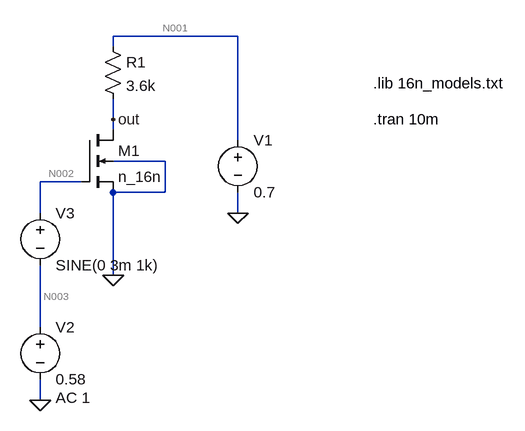
[diagram p0: schematic CS Stage - Resistive Load.asc]
CS Stage - Resistive Load.asc, the LTspice schematic file:
Version 4
SHEET 1 880 680
WIRE 128 -112 -64 -112
WIRE -64 -96 -64 -112
WIRE -64 16 -64 -16
WIRE -64 32 -64 16
WIRE 128 48 128 -112
WIRE 16 80 -64 80
WIRE -112 112 -176 112
WIRE 16 128 16 80
WIRE 16 128 -64 128
WIRE -176 160 -176 112
WIRE 128 160 128 128
WIRE -64 256 -64 128
WIRE -176 336 -176 240
WIRE -176 448 -176 416
FLAG -176 448 0
FLAG -64 256 0
FLAG 128 160 0
FLAG -64 16 out
SYMBOL nmos4 -112 32 R0
SYMATTR InstName M1
SYMATTR Value n_16n
SYMATTR Value2 l=32n w=900n
SYMBOL voltage 128 32 R0
WINDOW 123 0 0 Left 0
WINDOW 39 0 0 Left 0
SYMATTR InstName V1
SYMATTR Value 0.7
SYMBOL voltage -176 320 R0
WINDOW 123 24 124 Left 2
WINDOW 39 0 0 Left 0
SYMATTR Value2 AC 1
SYMATTR InstName V2
SYMATTR Value 0.58
SYMBOL res -80 -112 R0
SYMATTR InstName R1
SYMATTR Value 3.6k
SYMBOL voltage -176 144 R0
WINDOW 123 0 0 Left 0
WINDOW 39 0 0 Left 0
SYMATTR InstName V3
SYMATTR Value SINE(0 3m 1k)
TEXT 336 -40 Left 2 !.lib 16n_models.txt
TEXT 336 16 Left 2 !.tran 10m

The netlist it stands for:
* CS Stage - Resistive Load.asc
M1 out N002 0 0 n_16n l=32n w=900n
V1 N001 0 0.7
V2 N003 0 0.58 AC 1
R1 N001 out 3.6k
V3 N002 N003 SINE(0 3m 1k)
.model NMOS NMOS
.model PMOS PMOS
.lib standard.mos
.lib 16n_models.txt
.tran 10m
.backanno
.end

* Results of the author's LTspice run, read from the files saved beside the schematic
* Operating Point, zero values left out:
*   V(out) = 351 mV
*   V(n002) = 580 mV
*   V(n001) = 700 mV
*   V(n003) = 580 mV
*   Id(M1) = 96.93 µA
*   Ig(M1) = 525.1 pA
*   Ib(M1) = -2.496 pA
*   Is(M1) = -96.93 µA
*   I(R1) = 96.93 µA
*   I(V3) = -525.1 pA
*   I(V2) = -525.1 pA
*   I(V1) = -96.93 µA
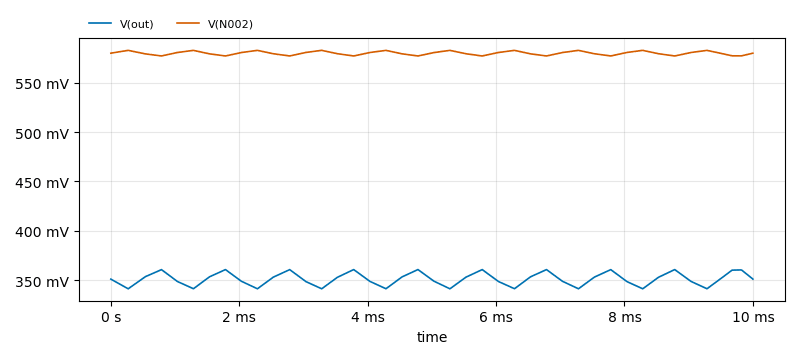
[diagram p1: Transient Analysis of CS Stage - Resistive Load.asc, plotted from the saved traces]
* Transient Analysis, 1 run:
*   V(out): min 341.2 mV, max 360.7 mV, average 351.1 mV, rms 351.1 mV, last 351 mV
*   V(N002): min 577.2 mV, max 582.8 mV, average 580 mV, rms 580 mV, last 580 mV